# EAGLE design 1541-parallel (EAGLE 9.1.3)
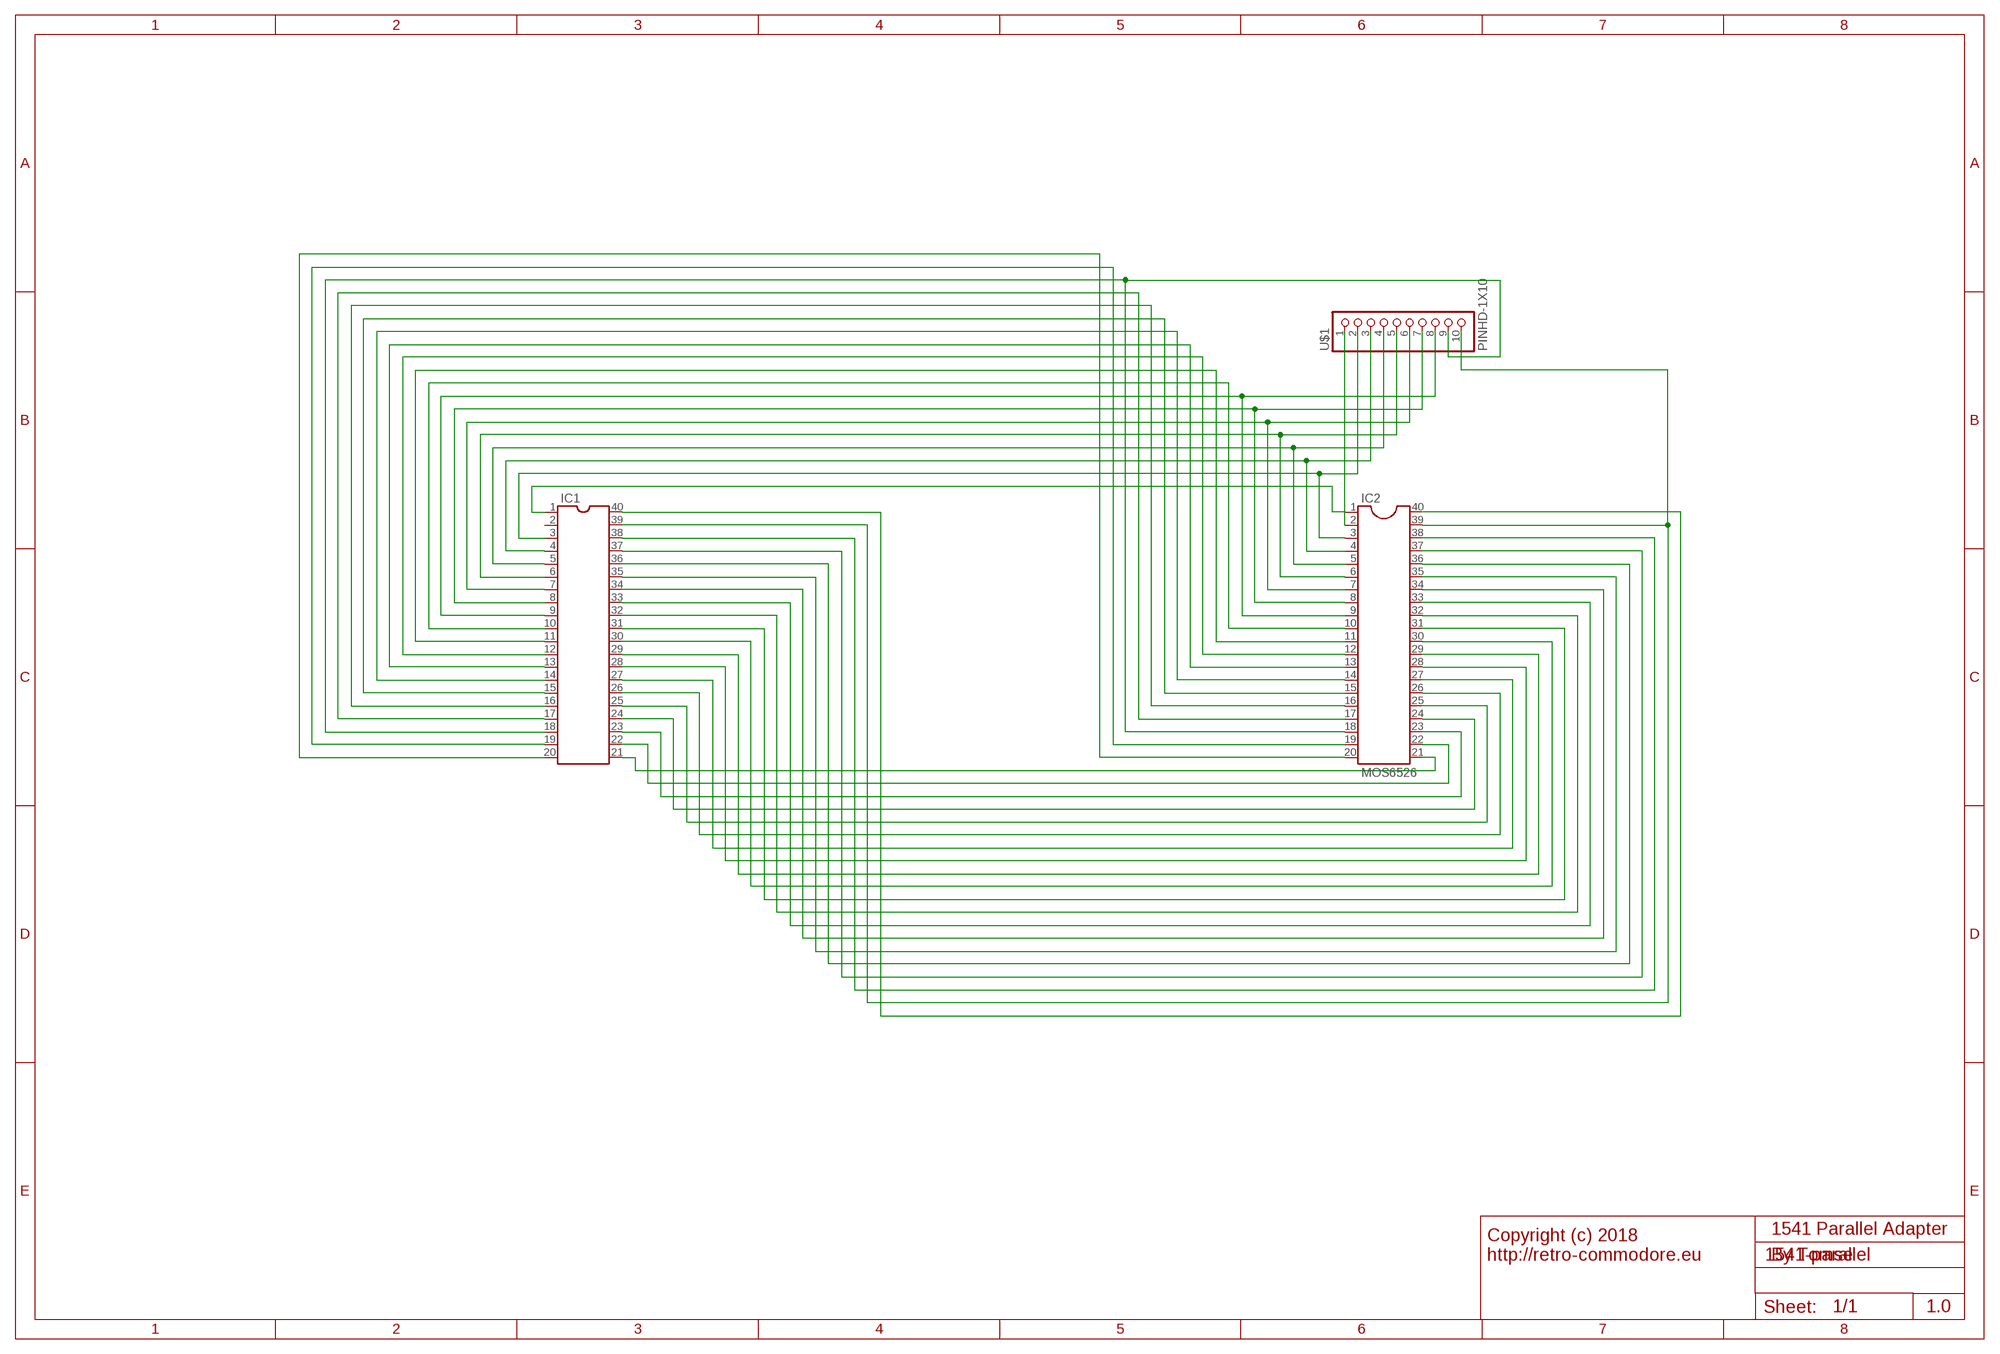
[diagram p0: schematic, sheet 1]

## Parts
IC1  IC-PACKAGE_DIL40  [IC-PACKAGE_DIL40]
IC2  MOS6526  DIL40  [DIL40]
U$1  PINHD-1X10  [1X10-BIG]

## Nets
N$1: IC1.1 IC2.1
N$2: IC1.3 IC2.3 U$1.2
N$3: IC1.4 IC2.4 U$1.3
N$4: IC1.5 IC2.5 U$1.4
N$5: IC1.6 IC2.6 U$1.5
N$6: IC1.7 IC2.7 U$1.6
N$7: IC1.8 IC2.8 U$1.7
N$8: IC1.9 IC2.9 U$1.8
N$9: IC1.10 IC2.10
N$10: IC1.11 IC2.11
N$11: IC1.12 IC2.12
N$12: IC1.13 IC2.13
N$13: IC1.14 IC2.14
N$14: IC1.15 IC2.15
N$15: IC1.16 IC2.16
N$16: IC1.17 IC2.17
N$17: IC1.18 IC2.18 U$1.9
N$18: IC1.19 IC2.19
N$19: IC1.20 IC2.20
N$20: IC1.21 IC2.21
N$21: IC1.22 IC2.22
N$22: IC1.23 IC2.23
N$23: IC1.24 IC2.24
N$24: IC1.25 IC2.25
N$25: IC1.26 IC2.26
N$26: IC1.27 IC2.27
N$27: IC1.28 IC2.28
N$28: IC1.29 IC2.29
N$29: IC1.30 IC2.30
N$30: IC1.31 IC2.31
N$31: IC1.32 IC2.32
N$32: IC1.33 IC2.33
N$33: IC1.34 IC2.34
N$34: IC1.35 IC2.35
N$35: IC1.36 IC2.36
N$36: IC1.37 IC2.37
N$37: IC1.38 IC2.38
N$38: IC1.39 IC2.39 U$1.10
N$39: IC1.40 IC2.40
N$40: IC2.2 U$1.1
Unconnected: IC1.2

## Notes on the sheet
- 1541 Parallel Adapter
- Copyright (c) 2018 
  http://retro-commodore.eu
- By Tomse
- 1.0

## Library data of the parts
IC1 = 1541-parallel:IC-PACKAGE_DIL40: Dual In Line
IC2 = ic-package:DIL40: Dual In Line; SPICEPREFIX: X
U$1 = adafruit:PINHD-1X10: Pin header 1x10 0.1" spacing With round pins

## Board
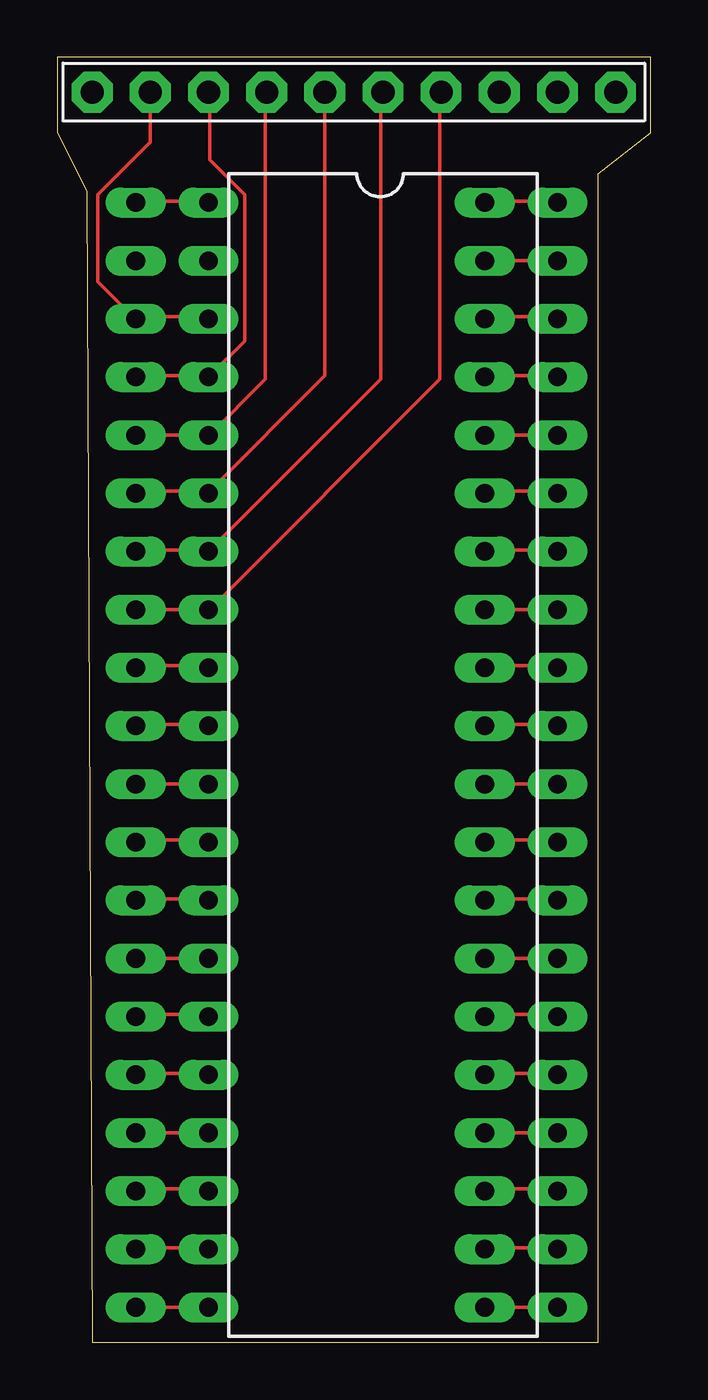
[diagram p1: board, top side]
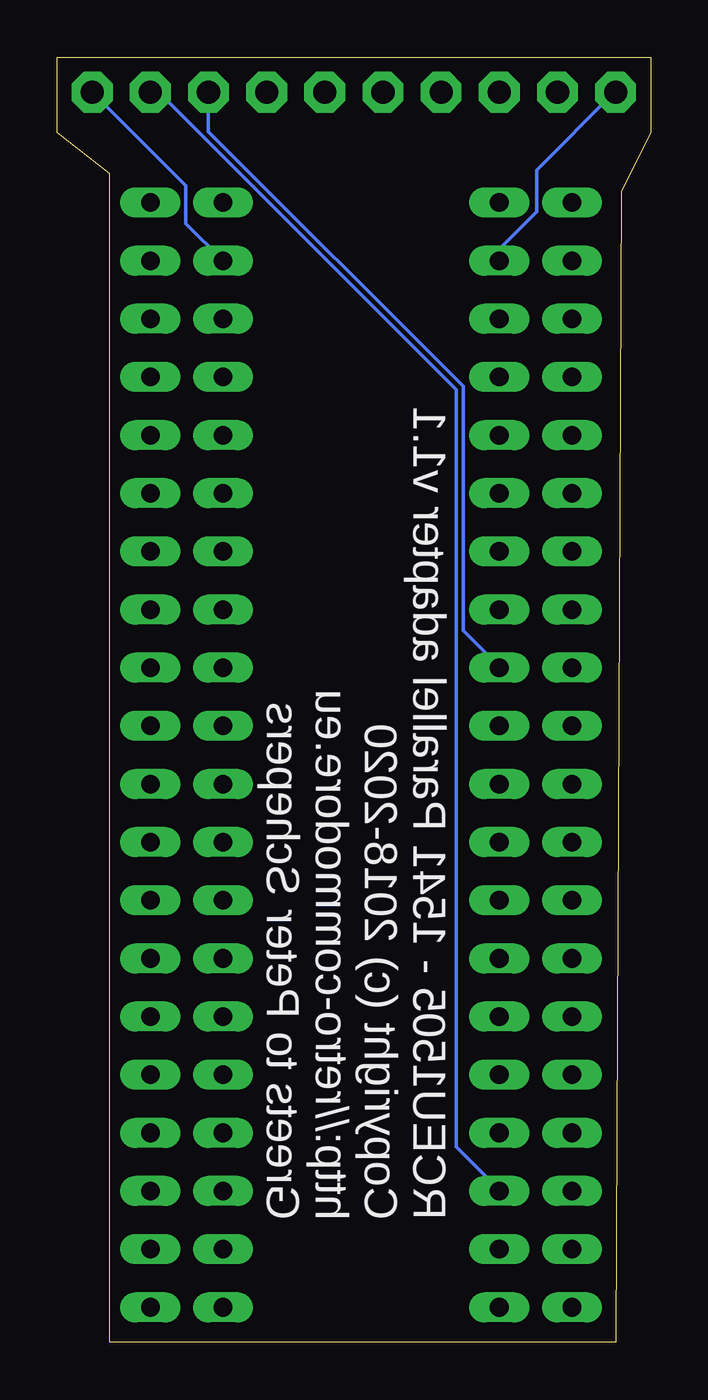
[diagram p2: board, bottom side, seen from below]

Size 25.91 x 56.14 mm. Coordinates in mm from the lower left corner, seen from the top.
Outline: 1.53,0 23.63,0 23.62,51.06 25.91,52.83 25.91,52.87 25.91,56.14 0,56.13 0,52.83 1.28,50.29 1.53,0
Copper layers (1*16): Top 0.035mm / dielectric 1.5mm / Bottom 0.035mm
Design rules "default": minimum track width 6mil, minimum drill 0.35mm, track to track 6mil, track to pad 6mil, pad to pad 6mil, via to via 6mil, smd to smd 6mil, copper to edge 40mil, drill to drill 6mil, minimum pad ring 10mil, minimum via ring 8mil, stop-mask expansion 4mil, vias tented up to drill 0mil, thermal gap 10mil

### Footprints (pad centres in the part's own frame; a part is rotated, then mirrored left to right if it is on the bottom)
IC-PACKAGE_DIL40 = drill 0.813 long: 1 -24.13,-7.62; 2 -21.59,-7.62; 3 -19.05,-7.62; 4 -16.51,-7.62; 5 -13.97,-7.62; 6 -11.43,-7.62; 7 -8.89,-7.62; 8 -6.35,-7.62; 9 -3.81,-7.62; 10 -1.27,-7.62; 11 1.27,-7.62; 12 3.81,-7.62; 13 6.35,-7.62; 14 8.89,-7.62; 15 11.43,-7.62; 16 13.97,-7.62; 17 16.51,-7.62; 18 19.05,-7.62; 19 21.59,-7.62; 20 24.13,-7.62; 21 24.13,7.62; 22 21.59,7.62; 23 19.05,7.62; 24 16.51,7.62; 25 13.97,7.62; 26 11.43,7.62; 27 8.89,7.62; 28 6.35,7.62; 29 3.81,7.62; 30 1.27,7.62; 31 -1.27,7.62; 32 -3.81,7.62; 33 -6.35,7.62; 34 -8.89,7.62; 35 -11.43,7.62; 36 -13.97,7.62; 37 -16.51,7.62; 38 -19.05,7.62; 39 -21.59,7.62; 40 -24.13,7.62
DIL40 = drill 0.813 long: 1 -24.13,-7.62; 2 -21.59,-7.62; 3 -19.05,-7.62; 4 -16.51,-7.62; 5 -13.97,-7.62; 6 -11.43,-7.62; 7 -8.89,-7.62; 8 -6.35,-7.62; 9 -3.81,-7.62; 10 -1.27,-7.62; 11 1.27,-7.62; 12 3.81,-7.62; 13 6.35,-7.62; 14 8.89,-7.62; 15 11.43,-7.62; 16 13.97,-7.62; 17 16.51,-7.62; 18 19.05,-7.62; 19 21.59,-7.62; 20 24.13,-7.62; 21 24.13,7.62; 22 21.59,7.62; 23 19.05,7.62; 24 16.51,7.62; 25 13.97,7.62; 26 11.43,7.62; 27 8.89,7.62; 28 6.35,7.62; 29 3.81,7.62; 30 1.27,7.62; 31 -1.27,7.62; 32 -3.81,7.62; 33 -6.35,7.62; 34 -8.89,7.62; 35 -11.43,7.62; 36 -13.97,7.62; 37 -16.51,7.62; 38 -19.05,7.62; 39 -21.59,7.62; 40 -24.13,7.62
1X10-BIG = drill 1.016 pad 1.778 octagon: 1 -11.43,0; 2 -8.89,0; 3 -6.35,0; 4 -3.81,0; 5 -1.27,0; 6 1.27,0; 7 3.81,0; 8 6.35,0; 9 8.89,0; 10 11.43,0

### Placement (x,y rotation side)
IC1  11.05,25.66 270 top
IC2  14.22,25.66 270 top
U$1  12.95,54.61 0 top

### Tracks (layer width: path | path; a pad name or v marks a point on that pad's centre or on a via)
N$1
  Top 0.152: IC1.1 3.45,49.84 6.5,49.84 IC2.1
N$2
  Top 0.152: IC2.3 6.5,44.81 3.45,44.81 IC1.3 3.3,44.81 1.78,46.33 1.78,50.14 4.06,52.43 4.06,54.56 U$1.2
N$3
  Top 0.152: IC1.4 3.45,42.22 6.5,42.22 IC2.4 6.66,42.22 8.18,43.74 8.18,50.14 6.66,51.67 6.66,54.56 U$1.3
N$4
  Top 0.152: IC1.5 3.45,39.63 6.5,39.63 IC2.5 6.66,39.63 9.09,42.06 9.09,54.56 U$1.4
N$5
  Top 0.152: IC1.6 3.45,37.19 6.5,37.19 IC2.6 6.66,37.19 11.68,42.22 11.68,54.56 U$1.5
N$6
  Top 0.152: IC1.7 3.45,34.6 6.5,34.6 IC2.7 6.66,34.6 14.12,42.06 14.12,54.56 U$1.6
N$7
  Top 0.152: IC1.8 3.45,32.01 6.5,32.01 IC2.8 6.66,32.01 16.71,42.06 16.71,54.56 U$1.7
N$8
  Top 0.152: IC1.9 3.45,29.57 6.5,29.57 IC2.9
  Bottom 0.152: U$1.8 19.3,54.56 19.3,52.89 8.18,41.76 8.18,31.09 6.66,29.57 IC2.9
N$9
  Top 0.152: IC1.10 3.45,26.98 6.5,26.98 IC2.10
N$10
  Top 0.152: IC1.11 3.45,24.39 6.5,24.39 IC2.11
N$11
  Top 0.152: IC1.12 3.45,21.95 6.5,21.95 IC2.12
N$12
  Top 0.152: IC1.13 3.45,19.36 6.5,19.36 IC2.13
N$13
  Top 0.152: IC1.14 3.45,16.77 6.5,16.77 IC2.14
N$14
  Top 0.152: IC1.15 3.45,14.33 6.5,14.33 IC2.15
N$15
  Top 0.152: IC1.16 3.45,11.74 6.5,11.74 IC2.16
N$16
  Top 0.152: IC1.17 3.45,9.15 6.5,9.15 IC2.17
N$17
  Top 0.152: IC1.18 3.45,6.71 6.5,6.71 IC2.18
  Bottom 0.152: U$1.9 21.74,54.56 21.44,54.56 8.48,41.61 8.48,8.54 6.66,6.71 IC2.18
N$18
  Top 0.152: IC1.19 3.45,4.12 6.5,4.12 IC2.19
N$19
  Top 0.152: IC1.20 3.45,1.53 6.5,1.53 IC2.20
N$20
  Top 0.152: IC1.21 18.69,1.53 21.74,1.53 IC2.21
N$21
  Top 0.152: IC1.22 18.69,4.12 21.74,4.12 IC2.22
N$22
  Top 0.152: IC1.23 18.69,6.71 21.74,6.71 IC2.23
N$23
  Top 0.152: IC1.24 18.69,9.15 21.74,9.15 IC2.24
N$24
  Top 0.152: IC1.25 18.69,11.74 21.74,11.74 IC2.25
N$25
  Top 0.152: IC1.26 18.69,14.33 21.74,14.33 IC2.26
N$26
  Top 0.152: IC1.27 18.69,16.77 21.74,16.77 IC2.27
N$27
  Top 0.152: IC1.28 18.69,19.36 21.74,19.36 IC2.28
N$28
  Top 0.152: IC1.29 18.69,21.95 21.74,21.95 IC2.29
N$29
  Top 0.152: IC1.30 18.69,24.39 21.74,24.39 IC2.30
N$30
  Top 0.152: IC1.31 18.69,26.98 21.74,26.98 IC2.31
N$31
  Top 0.152: IC1.32 18.69,29.57 21.74,29.57 IC2.32
N$32
  Top 0.152: IC1.33 18.69,32.01 21.74,32.01 IC2.33
N$33
  Top 0.152: IC1.34 18.69,34.6 21.74,34.6 IC2.34
N$34
  Top 0.152: IC1.35 18.69,37.19 21.74,37.19 IC2.35
N$35
  Top 0.152: IC1.36 18.69,39.63 21.74,39.63 IC2.36
N$36
  Top 0.152: IC1.37 18.69,42.22 21.74,42.22 IC2.37
N$37
  Top 0.152: IC1.38 18.69,44.81 21.74,44.81 IC2.38
N$38
  Top 0.152: IC1.39 18.69,47.25 21.74,47.25 IC2.39 | 21.9,47.25 IC2.39 | IC2.39 22.1,47.25
  Bottom 0.152: IC1.39 20.29,48.86 20.29,50.52 U$1.10
N$39
  Top 0.152: IC1.40 18.69,49.84 21.74,49.84 IC2.40
N$40
  Bottom 0.152: IC2.2 6.5,47.25 6.5,47.86 4.98,49.38 4.98,51.21 1.63,54.56 U$1.1

### Text on the board
bNames: RCEU1505 - 1541 Parallel adapter v1.1 / Copyright (c) 2018-2020 / http://retro-commodore.eu / Greets to Peter Schepers
tValues: 1
bValues: Solder Side